# EAGLE schematic Nosumor (EAGLE 9.5.2)
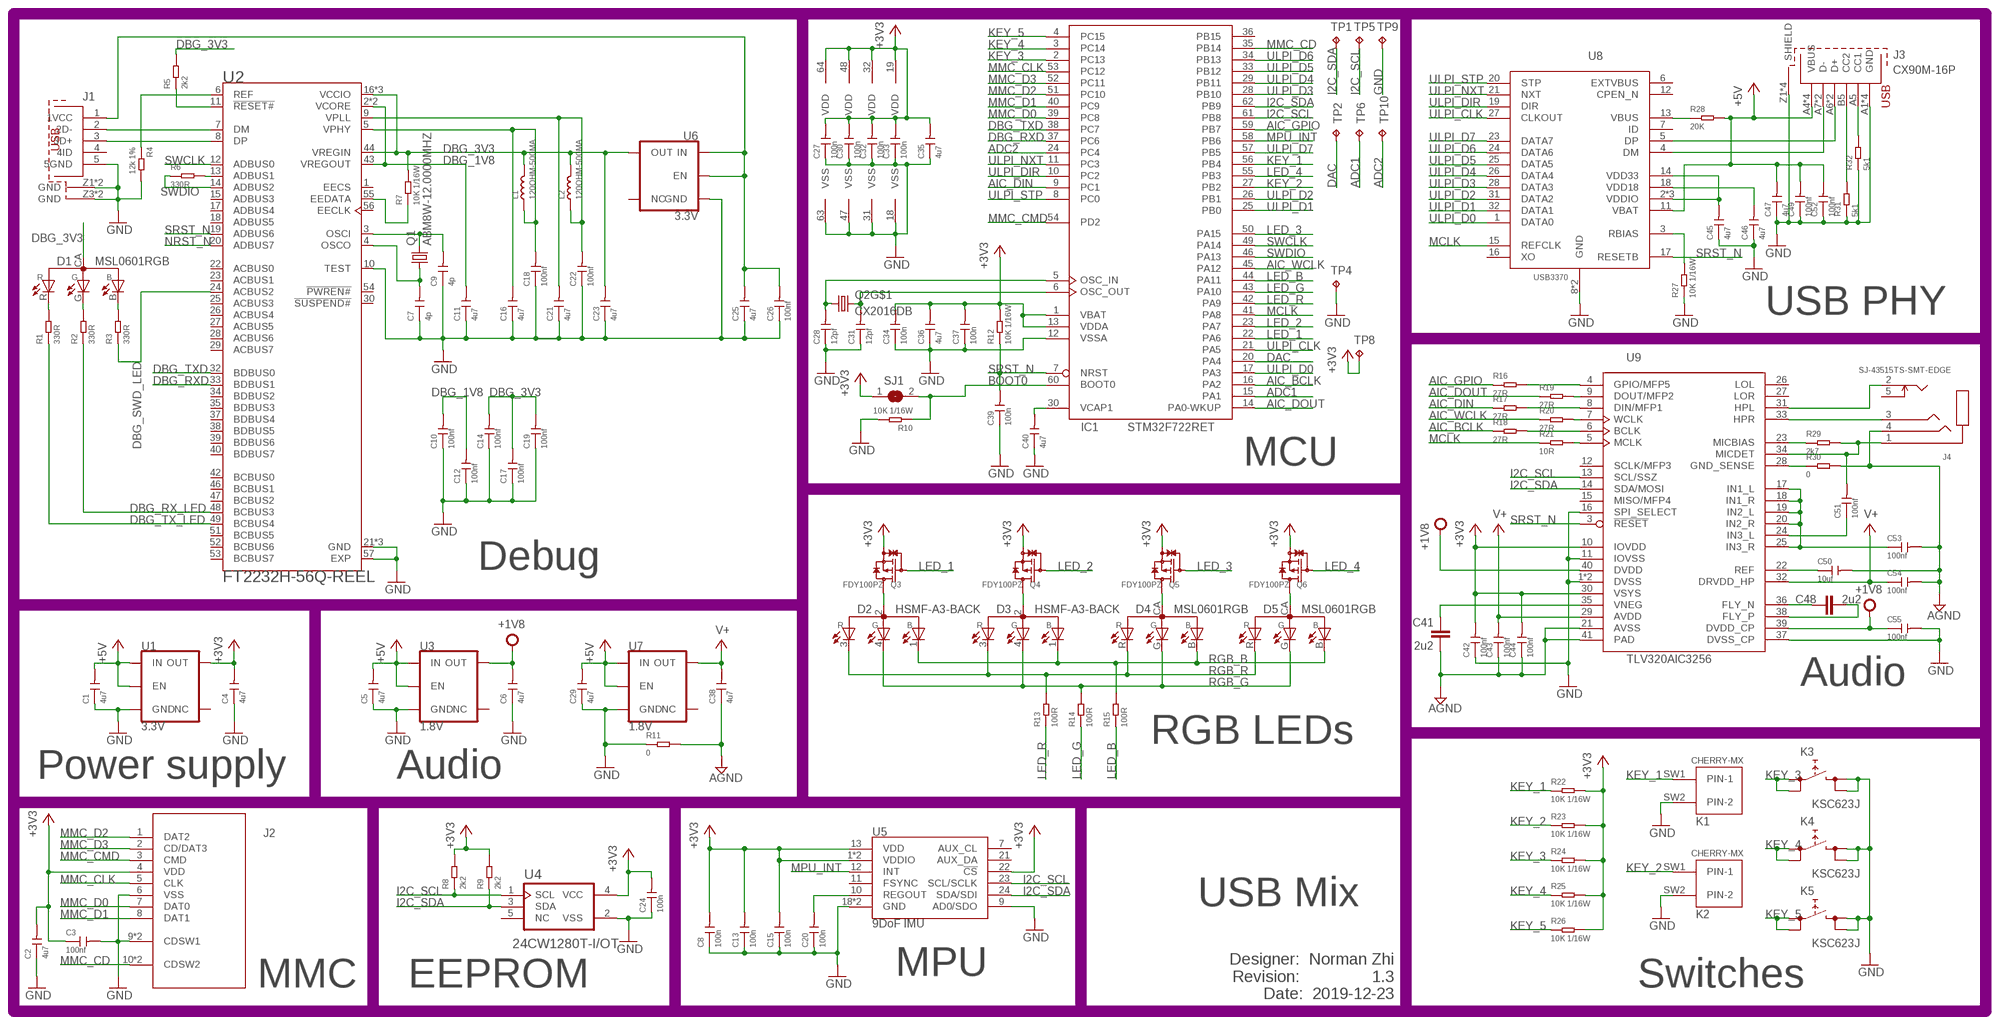
[diagram p0: schematic, sheet 1]

## Parts
C1  4u7  CERAMIC-1UF-6.3V-10%-X5R(0402)  [C0402]
C2  4u7  CERAMIC-1UF-6.3V-10%-X5R(0402)  [C0402]
C3  100nf  CERAMIC-100NF-25V-10%-X7R(0402)  [C0402]
C4  4u7  CERAMIC-1UF-6.3V-10%-X5R(0402)  [C0402]
C5  4u7  CERAMIC-1UF-6.3V-10%-X5R(0402)  [C0402]
C6  4u7  CERAMIC-1UF-6.3V-10%-X5R(0402)  [C0402]
C7  4p  CERAMIC-100NF-25V-10%-X7R(0402)  [C0402]
C8  100n  CERAMIC-100NF-25V-10%-X7R(0402)  [C0402]
C9  4p  CERAMIC-100NF-25V-10%-X7R(0402)  [C0402]
C10  100nf  CERAMIC-100NF-25V-10%-X7R(0402)  [C0402]
C11  4u7  CERAMIC-100NF-25V-10%-X7R(0402)  [C0402]
C12  100nf  CERAMIC-100NF-25V-10%-X7R(0402)  [C0402]
C13  100n  CERAMIC-100NF-25V-10%-X7R(0402)  [C0402]
C14  100nf  CERAMIC-100NF-25V-10%-X7R(0402)  [C0402]
C15  100n  CERAMIC-10NF-50V-10%-X7R(0402)  [C0402]
C16  4u7  CERAMIC-100NF-25V-10%-X7R(0402)  [C0402]
C17  100nf  CERAMIC-100NF-25V-10%-X7R(0402)  [C0402]
C18  100nf  CERAMIC-100NF-25V-10%-X7R(0402)  [C0402]
C19  100nf  CERAMIC-100NF-25V-10%-X7R(0402)  [C0402]
C20  100n  CERAMIC-100NF-25V-10%-X7R(0402)  [C0402]
C21  4u7  CERAMIC-100NF-25V-10%-X7R(0402)  [C0402]
C22  100nf  CERAMIC-100NF-25V-10%-X7R(0402)  [C0402]
C23  4u7  CERAMIC-1UF-6.3V-10%-X5R(0402)  [C0402]
C24  100n  CERAMIC-100NF-25V-10%-X7R(0402)  [C0402]
C25  4u7  CERAMIC-1UF-6.3V-10%-X5R(0402)  [C0402]
C26  100nf  CERAMIC-100NF-25V-10%-X7R(0402)  [C0402]
C27  100n  CERAMIC-100NF-25V-10%-X7R(0402)  [C0402]
C28  12pf  CERAMIC-12PF-50V-5%-NPO(0402)  [C0402]
C29  4u7  CERAMIC-1UF-6.3V-10%-X5R(0402)  [C0402]
C30  100n  CERAMIC-100NF-25V-10%-X7R(0402)  [C0402]
C31  12pf  CERAMIC-12PF-50V-5%-NPO(0402)  [C0402]
C32  100n  CERAMIC-100NF-25V-10%-X7R(0402)  [C0402]
C33  100n  CERAMIC-100NF-25V-10%-X7R(0402)  [C0402]
C34  100n  CERAMIC-10NF-50V-10%-X7R(0402)  [C0402]
C35  4u7  CERAMIC-4.7UF-10V-10%-X5R(0603)  [C0603]
C36  4u7  CERAMIC-4.7UF-10V-10%-X5R(0603)  [C0603]
C37  100n  CERAMIC-100NF-25V-10%-X7R(0402)  [C0402]
C38  4u7  CERAMIC-1UF-6.3V-10%-X5R(0402)  [C0402]
C39  100n  CERAMIC-100NF-25V-10%-X7R(0402)  [C0402]
C40  4u7  CERAMIC-4.7UF-10V-10%-X5R(0603)  [C0603]
C41  2u2  C-EUC0603K  [C0603K]
C42  100nf  CERAMIC-100NF-25V-10%-X7R(0402)  [C0402]
C43  100nf  CERAMIC-100NF-25V-10%-X7R(0402)  [C0402]
C44  100nf  CERAMIC-100NF-25V-10%-X7R(0402)  [C0402]
C45  4u7  CERAMIC-1UF-6.3V-10%-X5R(0402)  [C0402]
C46  4u7  CERAMIC-1UF-6.3V-10%-X5R(0402)  [C0402]
C47  4u7  CERAMIC-1UF-6.3V-10%-X5R(0402)  [C0402]
C48  2u2  C-EUC0603K  [C0603K]
C49  100nf  CERAMIC-100NF-25V-10%-X7R(0402)  [C0402]
C50  10uf  CERAMIC-10UF-10V-10%-X5R(0603)  [C0603]
C51  100nf  CERAMIC-100NF-25V-10%-X7R(0402)  [C0402]
C52  100nf  CERAMIC-100NF-25V-10%-X7R(0402)  [C0402]
C53  100nf  CERAMIC-100NF-25V-10%-X7R(0402)  [C0402]
C54  100nf  CERAMIC-100NF-25V-10%-X7R(0402)  [C0402]
C55  100nf  CERAMIC-100NF-25V-10%-X7R(0402)  [C0402]
D1  MSL0601RGB  [1105]
D2  HSMF-A3-BACK  [HSMF-A3-BACK]
D3  HSMF-A3-BACK  [HSMF-A3-BACK]
D4  MSL0601RGB  [1105]
D5  MSL0601RGB  [1105]
IC1  STM32F722RET  [LQFP64]
J1  629105150521  [629105150521]
J2  693071010811  [693071010811]
J3  CX90M-16P  [CX90M-16P]
J4  SJ-43515TS-SMT-EDGE  [SJ-4351*-SMT-MIRRORED-EDGE]
K1  CHERRY-MX  [CHERRY-MX]
K2  CHERRY-MX  [CHERRY-MX]
K3  KSC623J  [KSC-J]
K4  KSC623J  [KSC-J]
K5  KSC623J  [KSC-J]
L1  120OHM-500MA  SMD-FERRITE-CHIP-120-OHM-500MA(0603)  [L0603]
L2  120OHM-500MA  SMD-FERRITE-CHIP-120-OHM-500MA(0603)  [L0603]
Q1  ABM8W-12.0000MHZ  [ABM8W]
Q2  CX2016DB  [CX2016DB]
Q3  FDY100PZ  [SC-89]
Q4  FDY100PZ  [SC-89]
Q5  FDY100PZ  [SC-89]
Q6  FDY100PZ  [SC-89]
R1  330R  SMD-RES-330R-1%-1/16W(0402)  [R0402]
R2  330R  SMD-RES-330R-1%-1/16W(0402)  [R0402]
R3  330R  SMD-RES-330R-1%-1/16W(0402)  [R0402]
R4  12k 1%  SMD-RES-10K-1%-1/16W(0402)  [R0402]
R5  2k2  SMD-RES-10K-1%-1/16W(0402)  [R0402]
R6  330R  SMD-RES-470R-5%-1/16W(0402)  [R0402]
R7  10K 1/16W  SMD-RES-10K-1%-1/16W(0402)  [R0402]
R8  2k2  SMD-RES-10K-1%-1/16W(0402)  [R0402]
R9  2k2  SMD-RES-10K-1%-1/16W(0402)  [R0402]
R10  10K 1/16W  SMD-RES-10K-1%-1/16W(0402)  [R0402]
R11  0  SMD-RES-1K-5%-1/16W(0402)  [R0402]
R12  10K 1/16W  SMD-RES-10K-1%-1/16W(0402)  [R0402]
R13  100R  SMD-RES-330R-1%-1/16W(0402)  [R0402]
R14  100R  SMD-RES-330R-1%-1/16W(0402)  [R0402]
R15  100R  SMD-RES-330R-1%-1/16W(0402)  [R0402]
R16  27R  SMD-RES-330R-1%-1/16W(0402)  [R0402]
R17  27R  SMD-RES-330R-1%-1/16W(0402)  [R0402]
R18  27R  SMD-RES-330R-1%-1/16W(0402)  [R0402]
R19  27R  SMD-RES-330R-1%-1/16W(0402)  [R0402]
R20  27R  SMD-RES-330R-1%-1/16W(0402)  [R0402]
R21  10R  SMD-RES-330R-1%-1/16W(0402)  [R0402]
R22  10K 1/16W  SMD-RES-10K-1%-1/16W(0402)  [R0402]
R23  10K 1/16W  SMD-RES-10K-1%-1/16W(0402)  [R0402]
R24  10K 1/16W  SMD-RES-10K-1%-1/16W(0402)  [R0402]
R25  10K 1/16W  SMD-RES-10K-1%-1/16W(0402)  [R0402]
R26  10K 1/16W  SMD-RES-10K-1%-1/16W(0402)  [R0402]
R27  10K 1/16W  SMD-RES-10K-1%-1/16W(0402)  [R0402]
R28  20K  SMD-RES-1K-5%-1/16W(0402)  [R0402]
R29  2k7  SMD-RES-1K-5%-1/16W(0402)  [R0402]
R30  0  SMD-RES-1K-5%-1/16W(0402)  [R0402]
R31  5k1  SMD-RES-1K-5%-1/16W(0402)  [R0402]
R32  5k1  SMD-RES-1K-5%-1/16W(0402)  [R0402]
SJ1  SJ  [SJ]
TP1  TPB1,27  [B1,27]
TP2  TPB1,27  [B1,27]
TP4  TPB1,27  [B1,27]
TP5  TPB1,27  [B1,27]
TP6  TPB1,27  [B1,27]
TP8  TPB1,27  [B1,27]
TP9  TPB1,27  [B1,27]
TP10  TPB1,27  [B1,27]
U1  3.3V  V_REG_AP2112K-3.3V  [SOT23-5]
U2  FT2232H-56Q-REEL  [QFN50P800X800X100-57N]
U3  1.8V  V_REG_AP2112K-3.3V  [SOT23-5]
U4  24CW1280T-I/OT  [SOT95P280X145-5N]
U5  9DoF IMU  MPU-9250  [QFN24-3X3]
U6  3.3V  V_REG_AP2112K-3.3V  [SOT23-5]
U7  1.8V  V_REG_AP2112K-3.3V  [SOT23-5]
U8  USB3370  [QFN32]
U9  TLV320AIC3256  [QFN40P500X500X80-41N]

## Nets
+1V8: C6.2 C55.1 U3.5(OUT) U9.39(DVDD_CP) U9.40(DVDD)
+3V3: C2.2 C3.1 C4.2 C8.2 C13.2 C15.2 C24.2 C27.2 C30.2 C32.2 C33.2 C34.2 C35.2 C36.2 C37.2 C42.2 C44.2 IC1.1(VBAT) IC1.13(VDDA) IC1.19(VDD) IC1.32(VDD) IC1.48(VDD) IC1.64(VDD) J2.4(VDD) Q3.3(S) Q4.3(S) Q5.3(S) Q6.3(S) R8.2 R9.2 R12.2 R22.2 R23.2 R24.2 R25.2 R26.2 SJ1.1 TP8.TP U1.5(OUT) U4.4(VCC) U5.1(VDDIO) U5.8(VDDIO) U5.13(VDD) U5.22(!CS) U9.10(IOVDD) U9.30(VSYS)
+5V: C1.2 C5.2 C29.2 C47.2 C49.2 C52.2 J3.A4(VBUS) J3.A9(VBUS) J3.B4(VBUS) J3.B9(VBUS) R28.2 U1.1(IN) U1.3(EN) U3.1(IN) U3.3(EN) U7.1(IN) U7.3(EN) U8.11(VBAT)
ADC1: IC1.15(PA1) TP6.TP
ADC2: IC1.24(PC4) TP10.TP
AGND: C38.1 C41.2 C43.1 C44.1 C50.2 C53.2 C54.2 J4.4 R11.2 R30.2 U9.21(AVSS) U9.41(PAD)
AIC_BCLK: IC1.16(PA2) R18.1
AIC_BCLK_R: R18.2 U9.6(BCLK)
AIC_DIN: IC1.9(PC1) R17.1
AIC_DIN_R: R17.2 U9.8(DIN/MFP1)
AIC_DOUT: IC1.14(PA0-WKUP) R19.1
AIC_DOUT_R: R19.2 U9.9(DOUT/MFP2)
AIC_GPIO: IC1.59(PB7) R16.1
AIC_GPIO_R: R16.2 U9.4(GPIO/MFP5)
AIC_MCLK_R: R21.2 U9.5(MCLK)
AIC_WCLK: IC1.45(PA12) R20.1
AIC_WCLK_R: R20.2 U9.7(WCLK)
AVDD: C38.2 C43.2 C54.1 U7.5(OUT) U9.29(AVDD) U9.32(DRVDD_HP) ; supply symbol labelled V+
BOOT0: IC1.60(BOOT0) R10.1 SJ1.2
DAC: IC1.20(PA4) TP2.TP
DBG_1V8: C10.2 C11.2 C12.2 U2.2(VCORE) U2.31(VCORE) U2.43(VREGOUT)
DBG_3V3: C14.2 C17.2 C19.2 C23.2 D1.CA(A) L1.2 L2.2 R5.2 R7.2 U2.16(VCCIO) U2.36(VCCIO) U2.44(VREGIN) U2.50(VCCIO) U6.5(OUT)
DBG_DM: J1.2(2D-) U2.7(DM)
DBG_DP: J1.3(3D+) U2.8(DP)
DBG_RX_LED: R2.1 U2.48(BCBUS3)
DBG_RXD: IC1.37(PC6) U2.33(BDBUS1)
DBG_SWD_LED: R3.1 U2.24(ACBUS2)
DBG_TX_LED: R1.1 U2.49(BCBUS4)
DBG_TXD: IC1.38(PC7) U2.32(BDBUS0)
GND: C1.1 C2.1 C3.2 C4.1 C5.1 C6.1 C7.1 C8.1 C9.1 C10.1 C11.1 C12.1 C13.1 C14.1 C15.1 C16.1 C17.1 C18.1 C19.1 C20.1 C21.1 C22.1 C23.1 C24.1 C25.1 C26.1 C27.1 C28.1 C29.1 C30.1 C31.1 C32.1 C33.1 C34.1 C35.1 C36.1 C37.1 C39.1 C40.1 C42.1 C45.1 C46.1 C47.1 C49.1 C52.1 C55.2 IC1.12(VSSA) IC1.18(VSS) IC1.31(VSS) IC1.47(VSS) IC1.63(VSS) J1.5(5GND) J1.Z1(GND) J1.Z2(GND) J1.Z3(GND) J1.Z4(GND) J2.6(VSS) J2.9(CDSW1) J2.9-1(CDSW1) J3.A1(GND) J3.A12(GND) J3.B1(GND) J3.B12(GND) J3.Z1(SHIELD) J3.Z2(SHIELD) J3.Z3(SHIELD) J3.Z4(SHIELD) K1.SW2(PIN-2) K2.SW2(PIN-2) K3.2 K3.4 K4.2 K4.4 K5.2 K5.4 R4.2 R10.2 R11.1 R27.1 R31.1 R32.1 TP4.TP TP9.TP U1.2(GND) U2.10(TEST) U2.21(GND) U2.41(GND) U2.45(GND) U2.57(EXP) U3.2(GND) U4.2(VSS) U5.9(AD0/SDO) U5.18(GND) U5.20(GND) U6.2(GND) U7.2(GND) U8.8(GND) U8.EXP(GND) U9.1(DVSS) U9.2(DVSS) U9.11(IOVSS) U9.16(SPI_SELECT) U9.37(DVSS_CP)
I2C_SCL: IC1.61(PB8) R8.1 TP5.TP U4.1(SCL) U5.23(SCL/SCLK) U9.13(SCL/SSZ)
I2C_SDA: IC1.62(PB9) R9.1 TP1.TP U4.3(SDA) U5.24(SDA/SDI) U9.14(SDA/MOSI)
KEY_1: IC1.56(PB4) K1.SW1(PIN-1) R22.1
KEY_2: IC1.27(PB2) K2.SW1(PIN-1) R23.1
KEY_3: IC1.2(PC13) K3.1 K3.3 R24.1
KEY_4: IC1.3(PC14) K4.1 K4.3 R25.1
KEY_5: IC1.4(PC15) K5.1 K5.3 R26.1
LED_1: IC1.22(PA6) Q3.1(G)
LED_2: IC1.23(PA7) Q4.1(G)
LED_3: IC1.50(PA15) Q5.1(G)
LED_4: IC1.55(PB3) Q6.1(G)
LED_B: IC1.44(PA11) R15.1
LED_G: IC1.43(PA10) R14.1
LED_R: IC1.42(PA9) R13.1
MCLK: IC1.41(PA8) R21.1 U8.15(REFCLK)
MMC_CD: IC1.35(PB14) J2.10(CDSW2) J2.10-1(CDSW2)
MMC_CLK: IC1.53(PC12) J2.5(CLK)
MMC_CMD: IC1.54(PD2) J2.3(CMD)
MMC_D0: IC1.39(PC8) J2.7(DAT0)
MMC_D1: IC1.40(PC9) J2.8(DAT1)
MMC_D2: IC1.51(PC10) J2.1(DAT2)
MMC_D3: IC1.52(PC11) J2.2(CD/DAT3)
MPU_INT: IC1.58(PB6) U5.12(INT)
N$1: J3.A5(CC1) R32.2
N$4: J3.A7(D-) J3.B7(D-) U8.4(DM)
N$5: J3.A6(D+) J3.B6(D+) U8.5(DP)
N$6: J3.B5(CC2) R31.2
N$8: C9.2 Q1.P$3 U2.3(OSCI)
N$9: C7.2 Q1.P$1 U2.4(OSCO)
N$10: C51.1 U9.24(IN3_L)
N$11: D4.CA(A) Q5.2(D)
N$12: J4.3 U9.33(HPR)
N$13: J4.2 U9.31(HPL)
N$15: R7.1 U2.55(EEDATA)
N$16: D1.R(KR) R1.2
N$17: C51.2 J4.1 R29.2 U9.34(MICDET)
N$18: R29.1 U9.23(MICBIAS)
N$19: R30.1 U9.28(GND_SENSE)
N$20: C53.1 U9.17(IN1_L) U9.18(IN1_R) U9.19(IN2_L) U9.20(IN2_R) U9.25(IN3_R)
N$21: C50.1 U9.22(REF)
N$23: C48.1 U9.36(FLY_N)
N$24: C28.2 IC1.5(OSC_IN) Q2.1
N$25: C48.2 U9.38(FLY_P)
N$26: C31.2 IC1.6(OSC_OUT) Q2.3
N$28: D5.CA(A) Q6.2(D)
N$29: C40.2 IC1.30(VCAP1)
N$30: D1.G(KG) R2.2
N$32: R28.1 U8.13(VBUS)
N$34: D2.2(A) Q3.2(D)
N$37: R27.2 U8.3(RBIAS)
N$38: C41.1 U9.35(VNEG)
N$39: D3.2(A) Q4.2(D)
N$41: D1.B(KB) R3.2
N$42: C25.2 C26.2 J1.1(1VCC) U6.1(IN) U6.3(EN)
N$47: C20.2 U5.10(REGOUT)
N$52: R4.1 U2.6(REF)
N$53: R5.1 U2.11(!RESET#)
N$54: C16.2 C18.2 L1.1 U2.5(VPHY)
N$55: C21.2 C22.2 L2.1 U2.9(VPLL)
N$56: R6.2 U2.13(ADBUS1)
NRST_N: U2.20(ADBUS7)
RGB_B: D2.1(KB) D3.1(KB) D4.B(KB) D5.B(KB) R15.2
RGB_G: D2.4(KG) D3.4(KG) D4.G(KG) D5.G(KG) R14.2
RGB_R: D2.3(KR) D3.3(KR) D4.R(KR) D5.R(KR) R13.2
SRST_N: C39.2 IC1.7(NRST) R12.1 U2.19(ADBUS6) U8.17(RESETB) U9.3(!RESET)
SWCLK: IC1.49(PA14) U2.12(ADBUS0)
SWDIO: IC1.46(PA13) R6.1 U2.14(ADBUS2)
ULPI_CLK: IC1.21(PA5) U8.27(CLKOUT)
ULPI_D0: IC1.17(PA3) U8.1(DATA0)
ULPI_D1: IC1.25(PB0) U8.32(DATA1)
ULPI_D2: IC1.26(PB1) U8.31(DATA2)
ULPI_D3: IC1.28(PB10) U8.28(DATA3)
ULPI_D4: IC1.29(PB11) U8.26(DATA4)
ULPI_D5: IC1.33(PB12) U8.25(DATA5)
ULPI_D6: IC1.34(PB13) U8.24(DATA6)
ULPI_D7: IC1.57(PB5) U8.23(DATA7)
ULPI_DIR: IC1.10(PC2) U8.19(DIR)
ULPI_NXT: IC1.11(PC3) U8.21(NXT)
ULPI_STP: IC1.8(PC0) U8.20(STP)
VUSB18: C46.2 U8.18(VDD18)
VUSB33: C45.2 U8.2(VDDIO) U8.14(VDD33) U8.22(VDDIO) U8.30(VDDIO)
Unconnected: IC1.36(PB15) J1.4(4ID) J4.5 U1.4(NC) U2.1(EECS) U2.15(ADBUS3) U2.17(ADBUS4) U2.18(ADBUS5) U2.22(ACBUS0) U2.23(ACBUS1) U2.25(ACBUS3) U2.26(ACBUS4) U2.27(ACBUS5) U2.28(ACBUS6) U2.29(ACBUS7) U2.30(!SUSPEND#) U2.34(BDBUS2) U2.35(BDBUS3) U2.37(BDBUS4) U2.38(BDBUS5) U2.39(BDBUS6) U2.40(BDBUS7) U2.42(BCBUS0) U2.46(BCBUS1) U2.47(BCBUS2) U2.51(BCBUS5) U2.52(BCBUS6) U2.53(BCBUS7) U2.54(!PWREN#) U2.56(EECLK) U3.4(NC) U4.5(NC) U5.7(AUX_CL) U5.11(FSYNC) U5.21(AUX_DA) U6.4(NC) U7.4(NC) U8.6(EXTVBUS) U8.7(ID) U8.12(CPEN_N) U8.16(XO) U9.12(SCLK/MFP3) U9.15(MISO/MFP4) U9.26(LOL) U9.27(LOR)

## Notes on the sheet
- USB PHY
- MCU
- Debug
- Audio
- RGB LEDs
- Power supply | Audio
- USB Mix
- MMC | EEPROM | MPU | Switches
- Designer:  Norman Zhi
  Revision:                1.3
  Date:  2019-12-23

## Power pins joined to a net without a drawn wire
GND: Q2.2(GND)

## Library data of the parts
C1 C2 C4-C6 C23 C25 C29 C38 C45-C47 = Seeed-Capacitor:CERAMIC-1UF-6.3V-10%-X5R(0402): 302010003; MPN: CC0402KRX5R5BB105; VALUE: 1UF 6.3V
C3 C10 C12 C14 C17-C19 C22 C26 C42-C44 C49 C51-C55 = Seeed-Capacitor:CERAMIC-100NF-25V-10%-X7R(0402): 302010024; MPN: CC0402KRX7R8BB104
C7-C9 C11 C13 C16 C20 C21 C24 C27 C30 C32 C33 C37 C39 = Seeed-Capacitor:CERAMIC-100NF-25V-10%-X7R(0402): 302010024; MPN: CC0402KRX7R8BB104; VALUE: 100nf
C15 C34 = Seeed-Capacitor:CERAMIC-10NF-50V-10%-X7R(0402): 302010006; MPN: CC0402KRX7R9BB103; VALUE: 10nf
C28 C31 = Seeed-Capacitor:CERAMIC-12PF-50V-5%-NPO(0402): 302010049; MPN: CC0402JRNPO9BN120
C35 C36 C40 = Seeed-Capacitor:CERAMIC-4.7UF-10V-10%-X5R(0603): 302010111; MPN: CC0603KRX5R6BB475; VALUE: 4.7uf
C41 C48 = rcl:C-EU: CAPACITOR, European symbol; SPICEPREFIX: C
C50 = Seeed-Capacitor:CERAMIC-10UF-10V-10%-X5R(0603): 302010103; MPN: CC0603KRX5R6BB106
D1 D4 D5 = led:MSL0601RGB
D2 D3 = led:HSMF-A3: Avago HSMF-A3xx Series LEDs The HSMx-A3 series, from Avago Technologies, are a family of surface mount (SMT) tri-colour LED indicators. They come in the standard PLCC-4 package. The HSMx-A3 LEDs offer high reliability and are designed to tolerate a variety of environmental conditions.
IC1 = micro-stm_v3:STM32F722R*T: ARM 32-bit Cortex™-M7 CPU 216 MHz maximum frequency 256 to 512 Kbytes of Flash memory 256 kbytes of SRAM 50 GPIOs 1.7 to 3.6 V application supply
J1 = Wurth_Elektronik_Electromechanic_Input-Output_Connectors_rev16b:629105150521: WR-COM_USB_Micro Type B_Horizontal_SMT ; Micro Type B Horizontal SMT - 3A current at Pin1 & Pin 5 - with Pegs and THT shielding Pins - T&R Packaging Code : Con_I-O_COM_USB_2.0_B_629105150521_629105150521 <http://katalog.we-online.de/media/images/eican/Con_I-O_COM_USB_2.0_B_629105150521_pf2.jpg> Details see: http://katalog.we-online.de/em/datasheet/629105150521.pdf Created 12/08/2014, Dan Xu 2014 (C) Wurth Elektronik
J2 = Wurth_Elektronik_Electromechanic_Input-Output_Connectors_rev17b:693071010811: WR-CRD MICRO SD CARD CONNECTOR PUSH & PUSH WITH CARD DETECTION 8PINS=>Code : Con_I-O_COM_CRD_SD_Micro_693071010811 <http://katalog.we-online.de/media/images/eican/Con_I-O_COM_CRD_SD_Micro_693071010811_pf2.jpg> Details see: http://katalog.we-online.de/en/em/CRD_SD_MICRO_PUSH_AND_PULL_8_PINS/693071010811 Created 2014-07-09, Karrer Zheng 2014 (C) Würth Elektronik
J3 = connector:CX90M-16P: CX90M-16P USB-C USB 2.0 receptacle
J4 = connector:SJ-43515TS-SMT: Phone Connectors Audio Jacks
K1 K2 = cherrymx:CHERRY-MX: Cherry MX series keyswitch
K3-K5 = switch:KSC*J: C&K KSC Series Sealed Tact Switch for SMT KSC623J
L1 L2 = Seeed-Inductor:SMD-FERRITE-CHIP-120-OHM-500MA(0603): 303030001; MPN: BLM18AG121SN1D
Q1 = crystal:ABM?-*MHZ: ABRACON Surface Mount Crystal Range: 6.0 MHz to 125 MHz
Q2 = crystal:CX2016DB
Q3-Q6 = transistor:FDY100PZ: PowerTrench® P-Channel MOSFET, Fairchild Semiconductor
R1-R3 = Seeed-Resistor:SMD-RES-330R-1%-1/16W(0402): 301010466; MPN: RC0402FR-07330RL
R4 R5 R8 R9 = Seeed-Resistor:SMD-RES-10K-1%-1/16W(0402): 301010047; MPN: RC0402FR-0710KL; VALUE: 10K 1/16W
R6 = Seeed-Resistor:SMD-RES-470R-5%-1/16W(0402): 301010013; MPN: RC0402JR-07470RL; VALUE: 470R 1/16W
R7 R10 R12 R22-R27 = Seeed-Resistor:SMD-RES-10K-1%-1/16W(0402): 301010047; MPN: RC0402FR-0710KL
R11 R28-R32 = Seeed-Resistor:SMD-RES-1K-5%-1/16W(0402): 301010006; MPN: RC0402JR-071KL; VALUE: 1K
R13-R21 = Seeed-Resistor:SMD-RES-330R-1%-1/16W(0402): 301010466; MPN: RC0402FR-07330RL; VALUE: 330R
SJ1 = jumper:SJ: SMD solder JUMPER
TP1 TP2 TP4-TP6 TP8-TP10 = testpad:TP: Test pad
U1 U6 = SparkFun-IC-Power:V_REG_AP2112: AP2112 - 600mA CMOS LDO Regulator w/ Enable The AP2112 is CMOS process low dropout linear regulator with enable function, the regulator delivers a guaranteed 600mA (min.) continuous load current. Features Output Voltage Accuracy: ±1.5% Output Current: 600mA (Min.) Foldback Short Current Protection: 50mA Enable Function to Turn ON/OFF VOUT Low Dropout Voltage (3.3V): 250mV (Typ.) @IOUT=600mA Excellent Load Regulation: 0.2%/A (Typ.) Excellent Line Regulation: 0.02%/V (Typ.) Low Quiescent Current: 55μA (Typ.) Low Standby Current: 0.01μA (Typ.) Low Output Noise: 50μVRMS PSRR: 100Hz -65dB, 1kHz -65dB OTSD Protection Stable with 1.0μF Flexible Cap: Ceramic, Tantalum and Aluminum Electrolytic Operation Temperature Range: -40°C to 85°C ESD: MM 400V, HBM 4000V; PROD_ID: VREG-12457
U2 = FT2232H-56Q-REEL:FT2232H-56Q-REEL: Interface Bridge, Usb-Uart/Fifo, Qfn-56; DESCRIPTION: Interface Bridge, Usb-Uart/Fifo, Qfn-64; DIGI-KEY_PART_NUMBER: FT2232H-56Q-REEL-ND; DIGI-KEY_PURCHASE_URL: https://www.digikey.com/product-detail/en/ftdi-future-technology-devices-international-ltd/FT2232H-56Q-REEL/FT2232H-56Q-REEL-ND/5994691?utm_source=snapeda&utm_medium=aggregator&utm_campaign=symbol; MF: FTDI,; MP: FT2232H-56Q-REEL; PACKAGE: VQFN-56 FTDI
U3 U7 = SparkFun-IC-Power:V_REG_AP2112: AP2112 - 600mA CMOS LDO Regulator w/ Enable The AP2112 is CMOS process low dropout linear regulator with enable function, the regulator delivers a guaranteed 600mA (min.) continuous load current. Features Output Voltage Accuracy: ±1.5% Output Current: 600mA (Min.) Foldback Short Current Protection: 50mA Enable Function to Turn ON/OFF VOUT Low Dropout Voltage (3.3V): 250mV (Typ.) @IOUT=600mA Excellent Load Regulation: 0.2%/A (Typ.) Excellent Line Regulation: 0.02%/V (Typ.) Low Quiescent Current: 55μA (Typ.) Low Standby Current: 0.01μA (Typ.) Low Output Noise: 50μVRMS PSRR: 100Hz -65dB, 1kHz -65dB OTSD Protection Stable with 1.0μF Flexible Cap: Ceramic, Tantalum and Aluminum Electrolytic Operation Temperature Range: -40°C to 85°C ESD: MM 400V, HBM 4000V; PROD_ID: VREG-12457; VALUE: 3.3V
U4 = 24CW1280T-I_OT:24CW1280T-I/OT: None; AVAILABILITY: Unavailable; DESCRIPTION: 128 Kbit I2C Serial EEPROM With Software Write Protection, Industrial Temp; MF: Microchip; MP: 24CW1280T-I/OT; PACKAGE: SOT-23 Microchip; PRICE: None
U5 = SparkFun-Sensors:MPU-9250: MPU-9250 9 Degree of Freedom IMU System in Package that contains MPU-6500 & AK8963 NC pin 19. 2-6 & 14-17 not internally connected. May be used for PCB trace routing. Datasheet <https://cdn.sparkfun.com/assets/learn_tutorials/5/5/0/MPU9250REV1.0.pdf> SparkFun Products: SparkFun 9DoF Razor IMU M0 <https://www.sparkfun.com/products/14001> SparkFun IMU Breakout - MPU-9250 <https://www.sparkfun.com/products/13762>; PROD_ID: IC-13192
U8 = microchip:USB3370: Enhanced Single Supply Hi-Speed USB ULPI Transceiver
U9 = ti:TLV320AIC3256